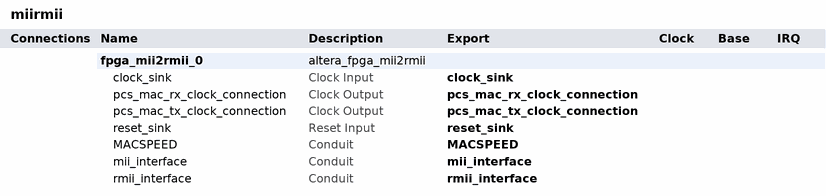
[diagram p0: system contents]
# Platform Designer (Qsys) system miirmii, Cyclone 10 LP 10CL025YU256I7G
# Parameters at their usual value, and those the tool derives, are not listed.
package require -exact qsys 25.1
create_system miirmii
set_project_property DEVICE_FAMILY {Cyclone 10 LP}
set_project_property DEVICE 10CL025YU256I7G

add_instance fpga_mii2rmii_0 altera_fpga_mii2rmii 25.1
set_instance_property fpga_mii2rmii_0 AUTO_EXPORT true
set_instance_parameter_value fpga_mii2rmii_0 MAC_SPEED true
set_instance_parameter_value fpga_mii2rmii_0 MBPS true
set_instance_parameter_value fpga_mii2rmii_0 RX_FIXED_THROUGHPUT true

# exported interfaces
add_interface MACSPEED conduit end
set_interface_property MACSPEED EXPORT_OF fpga_mii2rmii_0.MACSPEED
add_interface clock_sink clock sink
set_interface_property clock_sink EXPORT_OF fpga_mii2rmii_0.clock_sink
add_interface mii_interface conduit end
set_interface_property mii_interface EXPORT_OF fpga_mii2rmii_0.mii_interface
add_interface pcs_mac_rx_clock_connection clock source
set_interface_property pcs_mac_rx_clock_connection EXPORT_OF fpga_mii2rmii_0.pcs_mac_rx_clock_connection
add_interface pcs_mac_tx_clock_connection clock source
set_interface_property pcs_mac_tx_clock_connection EXPORT_OF fpga_mii2rmii_0.pcs_mac_tx_clock_connection
add_interface reset_sink reset sink
set_interface_property reset_sink EXPORT_OF fpga_mii2rmii_0.reset_sink
add_interface rmii_interface conduit end
set_interface_property rmii_interface EXPORT_OF fpga_mii2rmii_0.rmii_interface

set_interconnect_requirement {$system} qsys_mm.clockCrossingAdapter HANDSHAKE
set_interconnect_requirement {$system} qsys_mm.enableEccProtection FALSE
set_interconnect_requirement {$system} qsys_mm.insertDefaultSlave FALSE
set_interconnect_requirement {$system} qsys_mm.maxAdditionalLatency 1

save_system miirmii.qsys
